# Altium schematic sheet Power_Switch.SchDoc: Apalis Evaluation Board 1.1
size A3; Organization: Toradex AG; Address1: Altsagenstrasse 5; Address2: Horw; Address3: 6048; Address4: Switzerland; DocumentNumber: 4; Revision: V1.1; SheetNumber: 4; SheetTotal: 32; PageSetup: Record=PageOptions|CenterHorizontal=True|CenterVertical=True|PrintScale=0.73|XCorrection=1.00|YCorrection=1.00|PrintKind=0|BorderSize=5000000|LeftOffset=0|BottomOffset=0|Orientation=2|PaperLength=1000|PaperWidth=1000|Scale=100|PaperSource=7|PrintQuality=-4|MediaType=1|DitherType=10|PaperKind=A4|PrintScaleMode=1
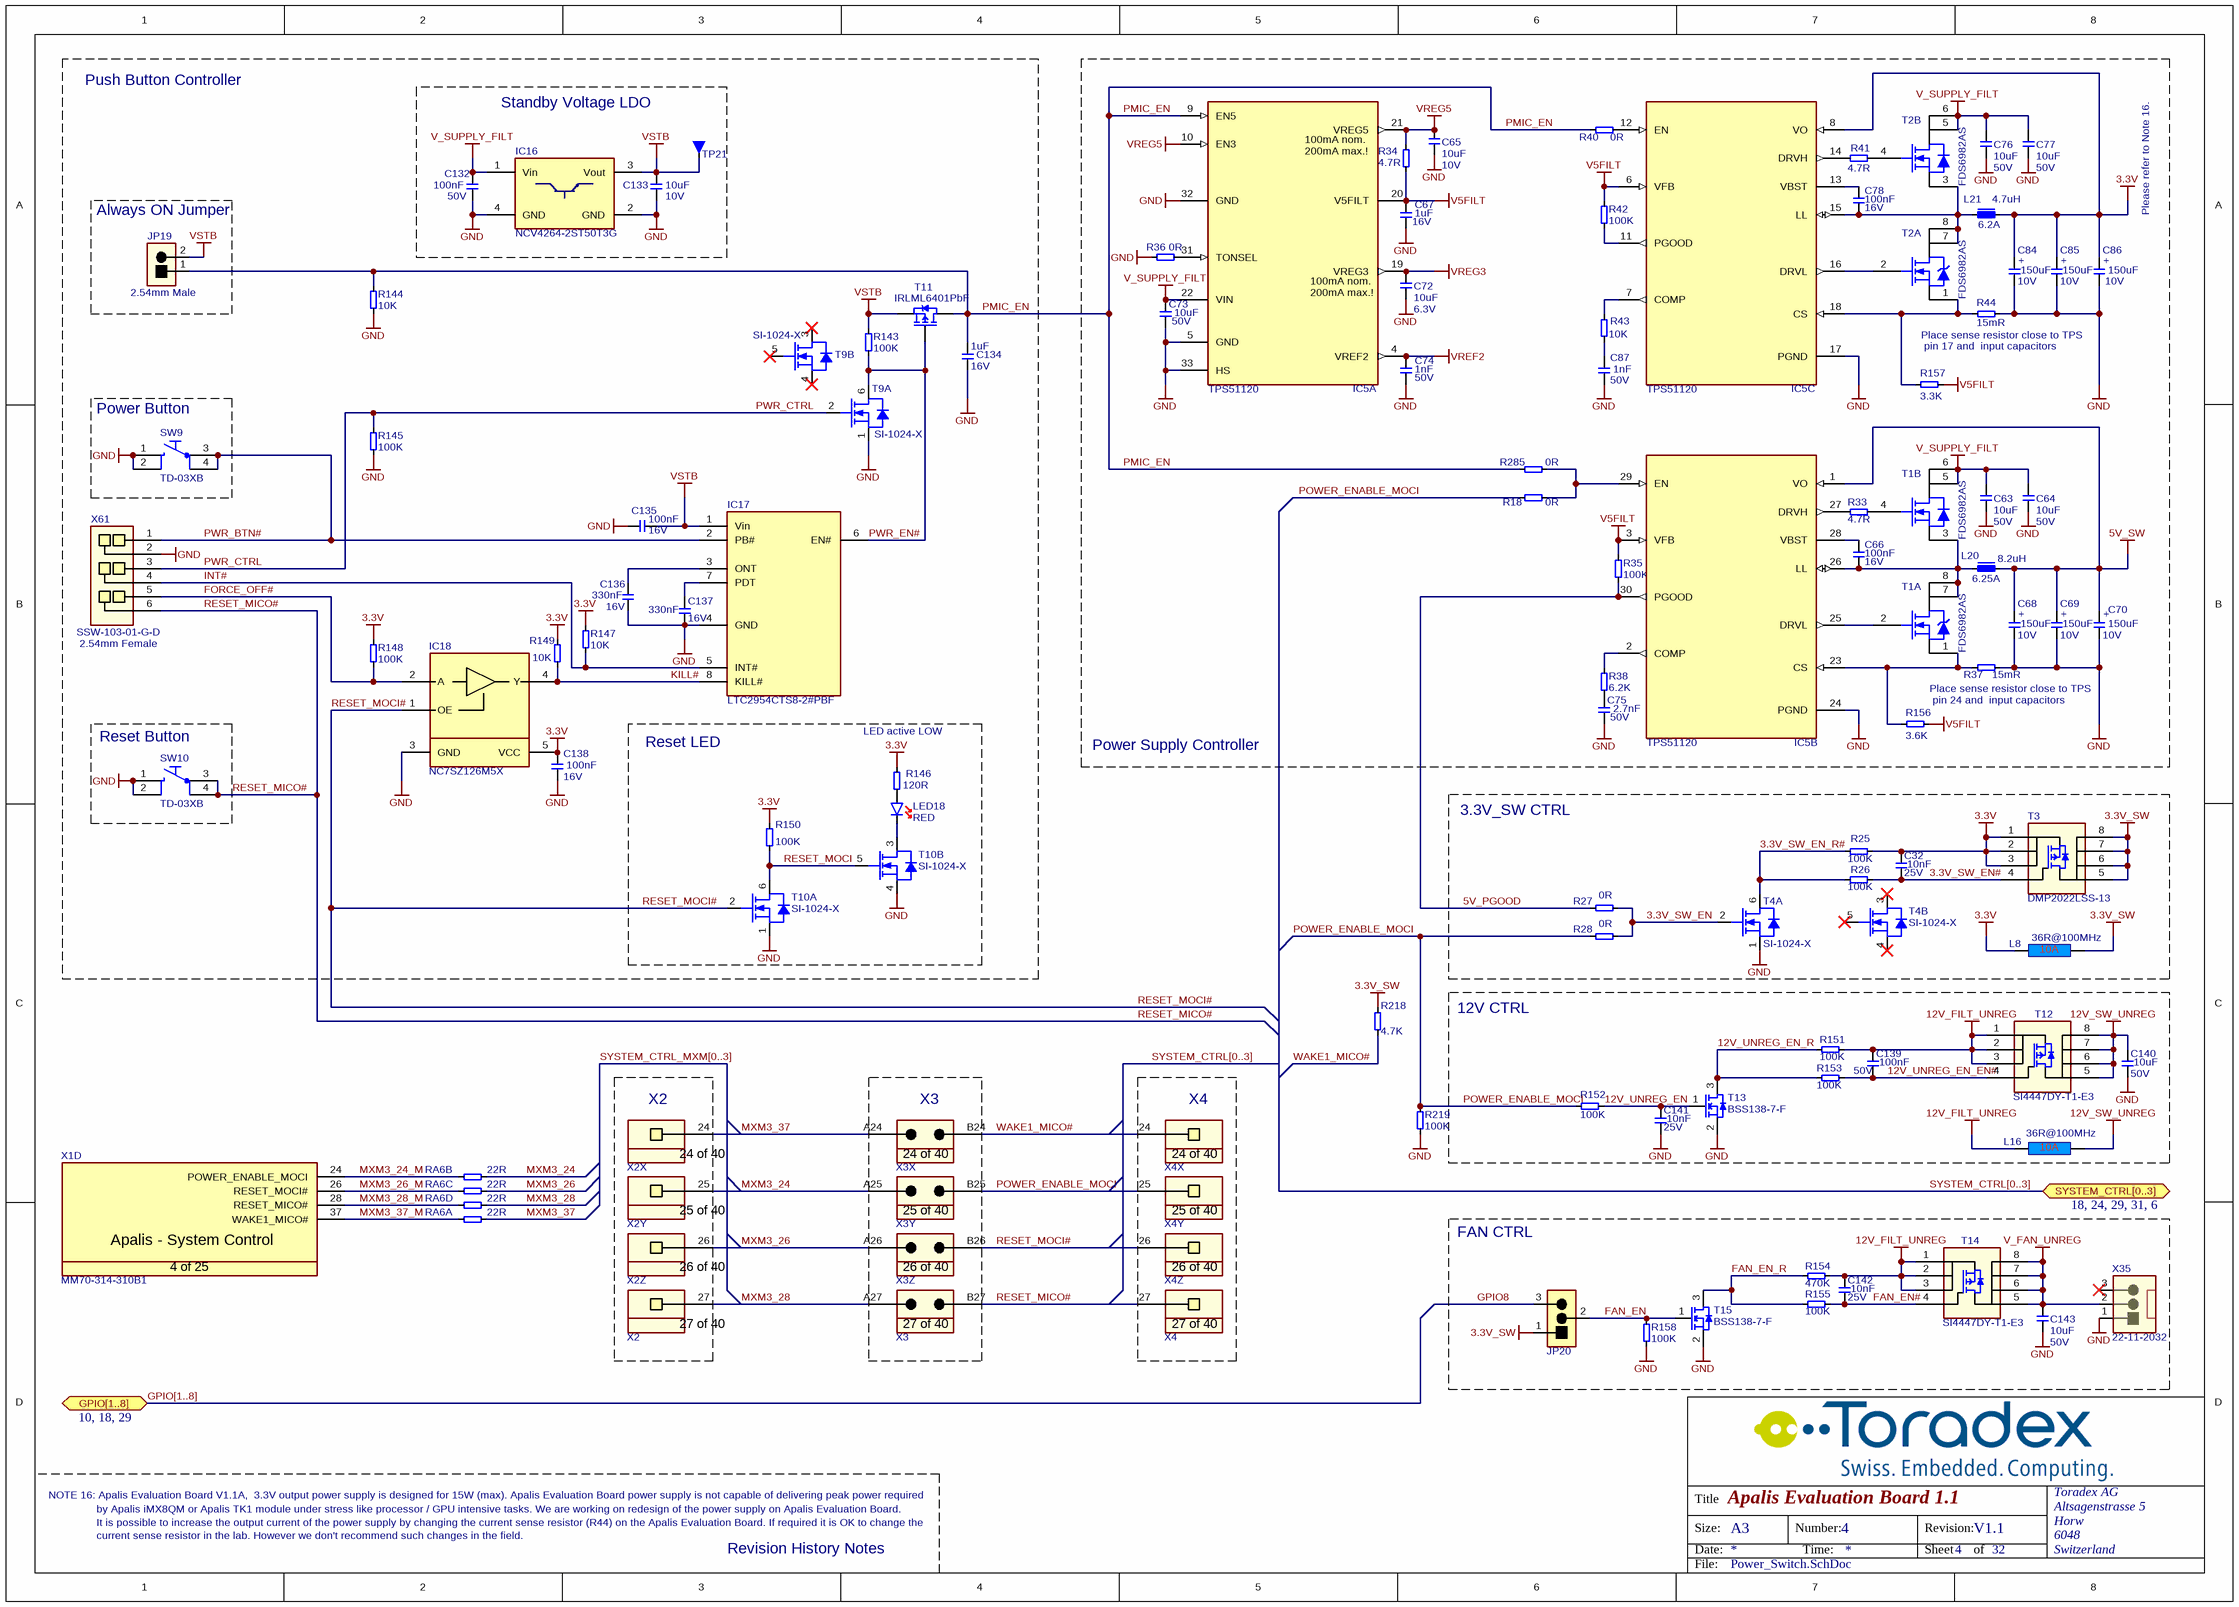
[diagram p0: Power_Switch.SchDoc]

## Parts
C32  Rating: 25V  [T_CAPC0603X33N]  (hidden comment: 10nF)
C63  Rating: 50V  [CAPC3225X160N]  (hidden comment: 10uF)
C64  Rating: 50V  [CAPC3225X160N]  (hidden comment: 10uF)
C65  Rating: 10V  [T_CAPC0805X125N]  (hidden comment: 10uF)
C66  Rating: 16V  [T_CAPC0603X33N]  (hidden comment: 100nF)
C67  Rating: 16V  [T_CAPC0603X33N]  (hidden comment: 1uF)
C68  Rating: 10V  [CAPMP7343X310N]  (hidden comment: 150uF)
C69  Rating: 10V  [CAPMP7343X310N]  (hidden comment: 150uF)
C70  Rating: 10V  [CAPMP7343X310N]  (hidden comment: 150uF)
C72  Rating: 6.3V  [T_CAPC0603X33N]  (hidden comment: 10uF)
C73  Rating: 50V  [CAPC3225X160N]  (hidden comment: 10uF)
C74  Rating: 50V  [T_CAPC0603X33N]  (hidden comment: 1nF)
C75  Rating: 50V  [CAPC1005X60N]  (hidden comment: 2.7nF)
C76  Rating: 50V  [CAPC3225X160N]  (hidden comment: 10uF)
C77  Rating: 50V  [CAPC3225X160N]  (hidden comment: 10uF)
C78  Rating: 16V  [T_CAPC0603X33N]  (hidden comment: 100nF)
C84  Rating: 10V  [CAPMP7343X310N]  (hidden comment: 150uF)
C85  Rating: 10V  [CAPMP7343X310N]  (hidden comment: 150uF)
C86  Rating: 10V  [CAPMP7343X310N]  (hidden comment: 150uF)
C87  Rating: 50V  [T_CAPC0603X33N]  (hidden comment: 1nF)
C132  Rating: 50V  [T_CAPC0603X33N]  (hidden comment: 100nF)
C133  Rating: 10V  [T_CAPC0805X125N]  (hidden comment: 10uF)
C134  Rating: 16V  [T_CAPC0603X33N]  (hidden comment: 1uF)
C135  Rating: 16V  [T_CAPC0603X33N]  (hidden comment: 100nF)
C136  Rating: 16V  [T_CAPC0805X125N]  (hidden comment: 330nF)
C137  Rating: 16V  [T_CAPC0805X125N]  (hidden comment: 330nF)
C138  Rating: 16V  [T_CAPC0603X33N]  (hidden comment: 100nF)
C139  Rating: 50V  [T_CAPC0603X33N]  (hidden comment: 100nF)
C140  Rating: 50V  [CAPC3225X160N]  (hidden comment: 10uF)
C141  Rating: 25V  [T_CAPC0603X33N]  (hidden comment: 10nF)
C142  Rating: 25V  [T_CAPC0603X33N]  (hidden comment: 10nF)
C143  Rating: 50V  [CAPC3225X160N]  (hidden comment: 10uF)
IC5  TPS51120  [QFN50P500X500X100-33N]  (parts A,B,C of 3)
IC16  NCV4264-2ST50T3G  [T_ON_NCV4264-2ST50T3G]
IC17  LTC2954CTS8-2#PBF  [T_LINEAR_LTC2954CTS8-2#PBF]
IC18  NC7SZ126M5X  [SOT95P279X142-5N]
JP19  TSW-101-07-G-D  [T_Samtec_TSW-101-07-G-D]  (value not drawn)
JP20  826936-3  [T_TYCO_826936-3]  (value not drawn)
L8  36R@100MHz  [T_Laird_35F0121-0SR-10]
L16  36R@100MHz  [T_Laird_35F0121-0SR-10]
L20  Rating: 6.25A  [T_INDM120120X80N]  (hidden comment: 8.2uH)
L21  Rating: 6.2A  [T_INDM102102X45N]  (hidden comment: 4.7uH)
LED18  Color: RED  [T_Osram_T670_RED]  (hidden comment: LS T670-K1L2-1)
R18  0R  [T_RESC0603X30N]
R25  100K  [T_RESC0603X30N]
R26  100K  [T_RESC0603X30N]
R27  0R  [T_RESC0603X30N]
R28  0R  [T_RESC0603X30N]
R33  4.7R  [RESC1005X40N]
R34  4.7R  [RESC1005X40N]
R35  100K  [T_RESC0603X30N]
R36  0R  [T_RESC0603X30N]
R37  15mR  [RESC3316X76N]
R38  6.2K  [RESC1005X40N]
R40  0R  [T_RESC0603X30N]
R41  4.7R  [RESC1005X40N]
R42  100K  [T_RESC0603X30N]
R43  10K  [RESC1005X40N]
R44  15mR  [RESC3316X76N]
R143  100K  [T_RESC0603X30N]
R144  10K  [T_RESC0603X30N]
R145  100K  [T_RESC0603X30N]
R146  120R  [T_RESC0603X30N]
R147  10K  [T_RESC0603X30N]
R148  100K  [T_RESC0603X30N]
R149  10K  [T_RESC0603X30N]
R150  100K  [T_RESC0603X30N]
R151  100K  [T_RESC0603X30N]
R152  100K  [T_RESC0603X30N]
R153  100K  [T_RESC0603X30N]
R154  470K  [T_RESC0603X30N]
R155  100K  [T_RESC0603X30N]
R156  3.6K  [T_RESC0603X30N]
R157  3.3K  [T_RESC0603X30N]
R158  100K  [T_RESC0603X30N]
R218  4.7K  [t_RESC0603X30N]
R219  100K  [T_RESC0603X30N]
R285  0R  [T_RESC0603X30N]
RA6  22R  [T_Resistor_Array_X4]  (parts A,B,C,D of 4)
SW9  TD-03XB  [T_WMF_TD-03XB]
SW10  TD-03XB  [T_WMF_TD-03XB]
T1  FDS6982AS  [SOIC127P600X173-8N]  (parts A,B of 2)
T2  FDS6982AS  [SOIC127P600X173-8N]  (parts A,B of 2)
T3  DMP2022LSS-13  [SOIC127P600X173-8N]
T4  Manufacturer Part No.: SI-1024-X  [SOTFL50P160X60-6N]  (hidden comment: T-Vishay-SI-1024X-N)  (parts A,B of 2)
T9  Manufacturer Part No.: SI-1024-X  [SOTFL50P160X60-6N]  (hidden comment: T-Vishay-SI-1024X-N)  (parts A,B of 2)
T10  Manufacturer Part No.: SI-1024-X  [SOTFL50P160X60-6N]  (hidden comment: T-Vishay-SI-1024X-N)  (parts A,B of 2)
T11  IRLML6401PbF  [SOT95P237X112-3N]
T12  SI4447DY-T1-E3  [SOIC127P600X173-8N]
T13  BSS138-7-F  [SOT95P237X112-3N]
T14  SI4447DY-T1-E3  [SOIC127P600X173-8N]
T15  BSS138-7-F  [SOT95P237X112-3N]
TP21  Testpin  [T_TP-THT]  (value not drawn)
X1  Manufacturer Part No.: MM70-314-310B1  [T_JAE_MM70-314-310B1]  (hidden comment: CON-JAE-MM70-314-310B1-314-0.5mm)  (part D of 25)
X2  SSW-110-01-G-S  [T_Samtec_SSW-110-01-G-S]  (value not drawn)  (parts X,Y,Z,27 of 40)
X3  TSW-110-07-G-D  [T_Samtec_TSW-110-07-G-D]  (value not drawn)  (parts X,Y,Z,27 of 40)
X4  SSW-110-01-G-S  [T_Samtec_SSW-110-01-G-S]  (value not drawn)  (parts X,Y,Z,27 of 40)
X35  22-11-2032  [T_MOLEX_22-11-2032]
X61  Manufacturer Part No.: SSW-103-01-G-D  [T_Samtec_SSW-103-01-G-D]  (hidden comment: TSW-103-01-G-D)

## Blocks framed on the sheet
Push Button Controller: C134-C138 IC17 IC18 R143-R145 R147-R149 T9 T11 X61
Power Supply Controller: C63-C70 C72-C78 C84-C87 IC5 L20 L21 R18 R33-R38 R40-R44 R156 R157 R285 T1 T2
Standby Voltage LDO: C132 C133 IC16 TP21
Always ON Jumper: JP19
Power Button: SW9
Reset Button: SW10
Reset LED: LED18 R146 R150 T10
3.3V_SW CTRL: C32 L8 R25-R28 T3 T4
12V CTRL: C139-C141 L16 R151-R153 T12 T13
X2: X2
X3: X3
X4: X4
FAN CTRL: C142 C143 JP20 R154 R155 R158 T14 T15 X35

## Ports
GPIO[1..8] (bidir, see 10, 18, 29), SYSTEM_CTRL[0..3] (bidir, see 18, 24, 29, 31, 6)

## Nets
3.3V: C32.2 C84.1 C85.1 C86.1 C138.1 IC5.8(VO) IC18.5(VCC) L8.1 L21.2 R25.1 R146.2 R147.1 R148.2 R149.1 R150.2 T3.1(S) T3.2(S) T3.3(S)
3.3V_SW: JP20.1 L8.2 R218.1 T3.5(D) T3.6(D) T3.7(D) T3.8(D)
5V_SW: C68.1 C69.1 C70.1 IC5.1(VO) L20.2
12V_FILT_UNREG: C139.2 C142.2 L16.1 R151.2 R154.2 T12.1(S) T12.2(S) T12.3(S) T14.1(S) T14.2(S) T14.3(S)
12V_SW_UNREG: C140.2 L16.2 T12.5(D) T12.6(D) T12.7(D) T12.8(D)
GND: C63.1 C64.1 C65.1 C67.1 C68.2 C69.2 C70.2 C72.1 C73.1 C74.1 C75.1 C76.1 C77.1 C84.2 C85.2 C86.2 C87.1 C132.1 C133.1 C134.1 C135.1 C136.1 C137.1 C138.2 C140.1 C141.1 C143.1 IC5.5(GND) IC5.17(PGND) IC5.24(PGND) IC5.32(GND) IC5.33(HS) IC16.2(GND) IC16.4(GND) IC17.4(GND) IC18.3(GND) R36.1 R37.2 R44.2 R144.1 R145.1 R158.2 R219.1 SW9.1 SW9.2 SW10.1 SW10.2 T4.1(S) T9.1(S) T10.1(S) T10.4(S) T13.2 T15.2 X35.1 X61.2
V5FILT: C67.2 IC5.3(VFB) IC5.6(VFB) IC5.20(V5FILT) R34.1 R35.2 R42.2 R156.2 R157.2
V_FAN_UNREG: C143.2 T14.5(D) T14.6(D) T14.7(D) T14.8(D) X35.2
V_SUPPLY_FILT: C63.2 C64.2 C73.2 C76.2 C77.2 C132.2 IC5.22(VIN) IC16.1(Vin) T1.5(D) T1.6(D) T2.5(D) T2.6(D)
VREF2: C74.2 IC5.4(VREF2)
VREG3: C72.2 IC5.19(VREG3)
VREG5: C65.2 IC5.10(EN3) IC5.21(VREG5) R34.2
VSTB: C133.2 C135.2 IC16.3(Vout) IC17.1(Vin) JP19.2 R143.2 T11.2 TP21.1
3.3V_SW_EN: R27.1 R28.2 T4.2(G)
3.3V_SW_EN#: C32.1 R26.1 T3.4(G)
3.3V_SW_EN_R#: R25.2 R26.2 T4.6(D)
5V_PGOOD: IC5.30(PGOOD) R27.2 R35.1
12V_UNREG_EN: C141.2 R152.2 T13.1
12V_UNREG_EN_EN#: C139.1 R153.2 T12.4(G)
12V_UNREG_EN_R: R151.1 R153.1 T13.3
FAN_EN: JP20.2 R158.1 T15.1
FAN_EN#: C142.1 R155.2 T14.4(G)
FAN_EN_R: R154.1 R155.1 T15.3
FORCE_OFF#: IC18.2(A) R148.1 X61.5
GPIO8: JP20.3
INT#: IC17.5(INT#) R147.2 X61.4
KILL#: IC17.8(KILL#) IC18.4(Y) R149.2
MXM3_24: RA6.6 X2.25 X3.A25
MXM3_24_M: RA6.2 X1.24(POWER_ENABLE_MOCI)
MXM3_26: RA6.7 X2.26 X3.A26
MXM3_26_M: RA6.3 X1.26(RESET_MOCI#)
MXM3_28: RA6.8 X2.27 X3.A27
MXM3_28_M: RA6.4 X1.28(RESET_MICO#)
MXM3_37: RA6.5 X2.24 X3.A24
MXM3_37_M: RA6.1 X1.37(WAKE1_MICO#)
PMIC_EN: C134.2 IC5.9(EN5) JP19.1 R40.1 R144.2 R285.1 T11.3
POWER_ENABLE_MOCI: R18.1 R28.1 R152.1 R219.2 X3.B25 X4.25
PWR_BTN#: IC17.2(PB#) SW9.3 SW9.4 X61.1
PWR_CTRL: R145.2 T9.2(G) X61.3
PWR_EN#: IC17.6(EN#) R143.1 T9.6(D) T11.1
RESET_MICO#: SW10.3 SW10.4 X3.B27 X4.27 X61.6
RESET_MOCI: R150.1 T10.5(G) T10.6(D)
RESET_MOCI#: IC18.1(OE) T10.2(G) X3.B26 X4.26
WAKE1_MICO#: R218.2 X3.B24 X4.24
NetC66_1: C66.1 IC5.26(LL) L20.1 T1.3(S) T1.7(D) T1.8(D)
NetC66_2: C66.2 IC5.28(VBST)
NetC75_2: C75.2 R38.1
NetC78_1: C78.1 IC5.15(LL) L21.1 T2.3(S) T2.7(D) T2.8(D)
NetC78_2: C78.2 IC5.13(VBST)
NetC87_2: C87.2 R43.1
NetC136_2: C136.2 IC17.3(ONT)
NetC137_2: C137.2 IC17.7(PDT)
NetIC5_2: IC5.2(COMP) R38.2
NetIC5_7: IC5.7(COMP) R43.2
NetIC5_11: IC5.11(PGOOD) R42.1
NetIC5_12: IC5.12(EN) R40.2
NetIC5_14: IC5.14(DRVH) R41.1
NetIC5_16: IC5.16(DRVL) T2.2(G)
NetIC5_18: IC5.18(CS) R44.1 R157.1 T2.1(S)
NetIC5_23: IC5.23(CS) R37.1 R156.1 T1.1(S)
NetIC5_25: IC5.25(DRVL) T1.2(G)
NetIC5_27: IC5.27(DRVH) R33.1
NetIC5_29: IC5.29(EN) R18.2 R285.2
NetIC5_31: IC5.31(TONSEL) R36.2
NetLED18_A: LED18.A R146.1
NetLED18_K: LED18.K T10.3(D)
NetR33_2: R33.2 T1.4(G)
NetR41_2: R41.2 T2.4(G)

Not connected (* = marked no-connect by the designer): T4 3(D)* 4(S)* 5(G)*; T9 3(D)* 4(S)* 5(G)*; X35 3*

## Buses and harness runs
bus GPIO[1..8] = port GPIO[1..8]
bus SYSTEM_CTRL[0..3] = port SYSTEM_CTRL[0..3]
bus SYSTEM_CTRL_MXM[0..3]

## Notes on the sheet
- Please refer to Note 16.
- (near JP19) 2.54mm Male
- (near R44) Place sense resistor close to TPS
- pin 17 and  input capacitors
- (near X61) 2.54mm Female
- Place sense resistor close to TPS
- LED active LOW
- pin 24 and  input capacitors
- NOTE 16: Apalis Evaluation Board V1.1A,  3.3V output power supply is designed for 15W (max). Apalis Evaluation Board power supply is not capable of delivering peak power required
- by Apalis iMX8QM or Apalis TK1 module under stress like processor / GPU intensive tasks. We are working on redesign of the power supply on Apalis Evaluation Board.
- It is possible to increase the output current of the power supply by changing the current sense resistor (R44) on the Apalis Evaluation Board. If required it is OK to change the
- current sense resistor in the lab. However we don't recommend such changes in the field.
- Revision History Notes
- Title
- Size:
- Date:
- A3
- Number:
- Time:
- Revision:
- Sheet
- of
- File:
- (in symbol C-TA-150uF-10V-10%-7343) +
- (in symbol CON-JAE-MM70-314-310B1-314-0.5mm, part D) Apalis - System Control; 4 of 25
- (in symbol CON-Samtec-SSW-110-01-G-S, part X) 24 of 40
- (in symbol CON-Samtec-SSW-110-01-G-S, part Y) 25 of 40
- (in symbol CON-Samtec-SSW-110-01-G-S, part Z) 26 of 40
- (in symbol CON-Samtec-SSW-110-01-G-S, part 27) 27 of 40
- (in symbol CON-Samtec-TSW-110-07-G-D, part X) 24 of 40
- (in symbol CON-Samtec-TSW-110-07-G-D, part Y) 25 of 40
- (in symbol CON-Samtec-TSW-110-07-G-D, part Z) 26 of 40
- (in symbol CON-Samtec-TSW-110-07-G-D, part 27) 27 of 40
- (in symbol IC-TI-TPS51120, part A) 100mA nom.; 200mA max.!

## Library data of the parts
C32 C141 C142 = C-X7R-10nF-25V-10%-0603: Capacitor Ceramic X7R 10nF 25V 10% 0603; Tolerance: 10%; Type: X7R; Value: 10nF
C63 C64 C73 C76 C77 C140 C143 = C-X5R-10uF-50V-20%-1210: Capacitor Ceramic X5R 10uF 50V 20% 1210; Tolerance: 20%; Type: X5R; Value: 10uF
C65 C133 = C-X5R-10uF-10V-20%-0805: Capacitor Ceramic X5R 10uF 10V 20% 0805; Tolerance: 20%; Type: X5R; Value: 10uF
C66 C78 C135 C138 = C-X7R-100nF-16V-10%-0603: Capacitor Ceramic X7R 100nF 16V 10% 0603; Tolerance: 10%; Type: X7R; Value: 100nF
C67 C134 = C-X5R-1uF-16V-20%-0603: Capacitor Ceramic X5R 1uF 16V 20% 0603; Tolerance: 20%; Type: X5R; Value: 1uF
C68-C70 C84-C86 = C-TA-150uF-10V-10%-7343: Capacitor TA 150uF 10V 10% 7343; Tolerance: 10%; Type: TA; Value: 150uF
C72 = C-X5R-10uF-6.3V-20%-0603: Capacitor Ceramic X5R 10uF 6.3V 20% 0603; Tolerance: 20%; Type: X5R; Value: 10uF
C74 C87 = C-X7R-1nF-50V-10%-0603: Capacitor Ceramic X7R 1nF 50V 10% 0603; Tolerance: 10%; Type: X7R; Value: 1nF
C75 = C-X7R-2.7nF-50V-10%-0402: Capacitor Ceramic X7R 2.7nF 50V 10% 0402; Tolerance: 10%; Type: X7R; Value: 2.7nF
C132 C139 = C-X7R-100nF-50V-20%-0603: Capacitor Ceramic X7R 100nF 50V 20% 0603; Tolerance: 20%; Type: X7R; Value: 100nF
C136 C137 = C-X7R-330nF-16V-10%-0805: Capacitor Ceramic X7R 330nF 16V 10% 0805; Tolerance: 10%; Type: X7R; Value: 330nF
IC5 = IC-TI-TPS51120: Power Supply Controller; Manufacturer Name: Texas Instruments; Manufacturer Part No.: TPS51120
IC16 = IC-ON-NCV4264-2ST50T3G: NCV4264-2ST50T3G LDO Regulator; Manufacturer Name: ON Semiconductor; Manufacturer Part No.: NCV4264-2ST50T3G
IC17 = IC-LIN-LTC2954CTS8-2#PBF: Push Button On/Off Controller; Manufacturer Name: Linear; Manufacturer Part No.: LTC2954CTS8-2#PBF
IC18 = IC-FAR-NC7SZ126M5X: NC7SZ126M5X  Buffer Three-State Output; Manufacturer Name: Fairchild Semiconductor; Manufacturer Part No.: NC7SZ126M5X
JP19 = CON-Samtec-TSW-101-07-G-D: Header male, 1x2 Pins, 2.54 mm pitch; Manufacturer Name: Samtec; Pitch: 2.54 mm; No. of ways: 1x2; Manufacturer Part no.: TSW-101-07-G-D
JP20 = CON-Tyco-826936-3-1X3-2.54mm-JP_1: Jumper, 3-Pin; Manufacturer Name: Tyco; No. of ways: 1X3; Pitch: 2.54mm; Manufacturer Part No.: 826936-3
L8 L16 = L-Laird-35F0121-0SR-10-10A-25%: Power Supply FB 10A; Tolerance: 25%; Rating: 10A; Value: 36R@100MHz
L20 = L-Wurth-744771008-8.2uH-6.25A-20%: Inductance 8.2uH 6.25A 20%; Manufacturer Name: Wurth; Tolerance: 20%; Manufacturer Part No.: 744771008; Value: 8.2uH
L21 = L-Wurth-7447797470-4.7uH-6.2A-20%: Inductance 4.7uH 6.2A 20%; Manufacturer Name: Wurth; Tolerance: 20%; Manufacturer Part No.: 7447797470; Value: 4.7uH
LED18 = LED-Osram-LS T670-K1L2-1: LED red, Osram LS T670-K1L2-1; Manufacturer Name: Osram; Manufacturer Part No.: LS T670-K1L2-1
R18 R27 R28 R36 R40 R285 = R-0R-63mW-1%-0603: Resistor 0 ohm 63mW 1% 0603; Rating: 63mW; Tolerance: 1%; Value: 0R
R25 R26 R35 R42 R143 R145 R148 R150-R153 R155 R158 R219 = R-100KR-63mW-5%-0603: Resistor 100 Kohm 63mW 5% 0603; Value: 100KR; Rating: 63mW; Tolerance: 5%
R33 R34 R41 = R-4.7R-63mW-5%-0402: Resistor 4.7 ohm 63mW 5% 0402; Rating: 63mW; Tolerance: 5%; Value: 4.7R
R37 R44 = R-15mR-250mW-1%-1206: Resistor 15 mohm 250mW 1% 1206; Rating: 250mW; Tolerance: 1%; Value: 15mR
R38 = R-6.2KR-63mW-1%-0402: Resistor 6.2 Kohm 63mW 1% 0402; Value: 6.2KR; Rating: 63mW; Tolerance: 1%
R43 = R-10KR-63mW-1%-0402: Resistor 10 Kohm 63mW 1% 0402; Value: 10KR; Rating: 63mW; Tolerance: 1%
R144 R147 R149 = R-10KR-63mW-5%-0603: Resistor 10 Kohm 63mW 5% 0603; Value: 10KR; Rating: 63mW; Tolerance: 5%
R146 = R-120R-63mW-5%-0603: Resistor 120 ohm 63mW 5% 0603; Rating: 63mW; Tolerance: 5%; Value: 120R
R154 = R-470KR-63mW-5%-0603: Resistor 470 Kohm 63mW 5% 0603; Value: 470KR; Rating: 63mW; Tolerance: 5%
R156 = R-3.6KR-63mW-1%-0603: Resistor 3.6 Kohm 63mW 1% 0603; Value: 3.6KR; Rating: 63mW; Tolerance: 1%
R157 = R-3.3KR-63mW-1%-0603: Resistor 3.3 Kohm 63mW 1% 0603; Value: 3.3KR; Rating: 63mW; Tolerance: 1%
R218 = R-4.7kR-63mW-5%-0603: Resistor 4.7 Kohm 63mW 5% 0603; Value: 4.7KR; Rating: 63mW; Tolerance: 5%
RA6 = RA-22R-63mW-5%-1206-div: Resistor Array 22 R 63mW 5% 1206; Tolerance: 5%; Power Dissipation: 63mW; Value: 22R
SW9 SW10 = SW-WMF-TD-03XB: Push Button; Manufacturer Name: WMF; Rating: 50mA; Manufacturer Part No.: TD-03XB
T1 T2 = T-Fairchild-FDS6982AS-N: N-Channel PowerTrench SyncFET; Manufacturer Name: Fairchild; Manufacturer Part No.: FDS6982AS
T3 = T-Diodes-DMP2022LSS-13-8-SOIC: p-channel MOSFET, DMP2022LSS-13; Manufacturer Name: DIODES; Manufacturer Part No.: DMP2022LSS-13
T4 T9 T10 = T-Vishay-SI-1024X-N: Dual N-Channel 20V (D-S)  MOSFET; Manufacturer Name: Vishay
T11 = T-IR-IRLML6401PbF-SOT-23: p-channel MOSFET, IRLML6401PbF; Manufacturer Name: International Rectifier; Manufacturer Part No.: IRLML6401PbF
T12 T14 = T-Vishay-SI4447DY-T1-E3: p-channel MOSFET, SI4447DY-T1-E3; Manufacturer Name: Vishay; Manufacturer Part No.: SI4447DY-T1-E3
T13 T15 = T-Diodes-BSS138-7-F: N-channel MOSFET, BSS138-7-F; Manufacturer Name: Diodes; Manufacturer Part No.: BSS138-7-F
TP21 = Testpin: Testpin TH
X1 = CON-JAE-MM70-314-310B1-314-0.5mm: MXM3 Connector; Manufacturer Name: JAE; No. of ways: 314
X2 X4 = CON-Samtec-SSW-110-01-G-S: Receptacle Female Socket 1x40 pin 2.54mm pitch; Manufacturer Name: Samtec; Pitch: 2.54mm; No. of ways: 1x40; Manufacturer Part No.: SSW-110-01-G-S
X3 = CON-Samtec-TSW-110-07-G-D: Header 2x40 pin 2.54mm pitch; Manufacturer Name: Samtec; Pitch: 2.54mm; No. of ways: 2x40; Manufacturer Part No.: TSW-110-07-G-D
X35 = CON-Molex-22-11-2032: Header with Friction Lock; Manufacturer Name: Molex; No. of ways: 3; Manufacturer Part No.: 22-11-2032
X61 = CON-Samtec-SSW-103-01-G-D: Receptacle Female Socket, 2x3 Pins, 2.54mm pitch; Manufacturer Name: Samtec; No. of ways: 2x3; Pitch: 2.54mm